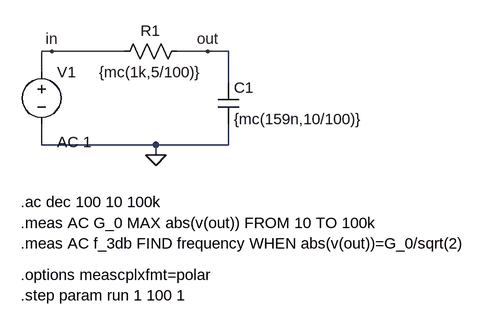
[diagram p0: schematic circuitoRC.asc]
circuitoRC.asc, the LTspice schematic file:
Version 4
SHEET 1 880 680
WIRE 48 48 32 48
WIRE 160 48 48 48
WIRE 288 48 240 48
WIRE 320 48 288 48
WIRE 32 80 32 48
WIRE 320 96 320 48
WIRE 32 192 32 160
WIRE 208 192 32 192
WIRE 320 192 320 160
WIRE 320 192 208 192
WIRE 208 208 208 192
FLAG 208 208 0
FLAG 48 48 in
FLAG 288 48 out
SYMBOL voltage 32 64 R0
WINDOW 123 24 124 Left 2
WINDOW 39 0 0 Left 0
SYMATTR Value2 AC 1
SYMATTR InstName V1
SYMATTR Value ""
SYMBOL res 256 32 R90
WINDOW 0 0 56 VBottom 2
WINDOW 3 32 56 VTop 2
SYMATTR InstName R1
SYMATTR Value {mc(1k,5/100)}
SYMBOL cap 304 96 R0
SYMATTR InstName C1
SYMATTR Value {mc(159n,10/100)}
TEXT 0 280 Left 2 !.ac dec 100 10 100k
TEXT 0 312 Left 2 !.meas AC G_0 MAX abs(v(out)) FROM 10 TO 100k
TEXT 0 344 Left 2 !.meas AC f_3db FIND frequency WHEN abs(v(out))=G_0/sqrt(2)
TEXT 0 392 Left 2 !.options meascplxfmt=polar
TEXT 0 424 Left 2 !.step param run 1 100 1

The netlist it stands for:
* circuitoRC.asc
V1 in 0 AC 1
R1 out in {mc(1k,5/100)}
C1 out 0 {mc(159n,10/100)}
.ac dec 100 10 100k
.meas AC G_0 MAX abs(v(out)) FROM 10 TO 100k
.meas AC f_3db FIND frequency WHEN abs(v(out))=G_0/sqrt(2)
.options meascplxfmt=polar
.step param run 1 100 1
.backanno
.end